# EAGLE schematic Ferdinand16 (EAGLE 7.5.0)
DESIGNER: Adam Green
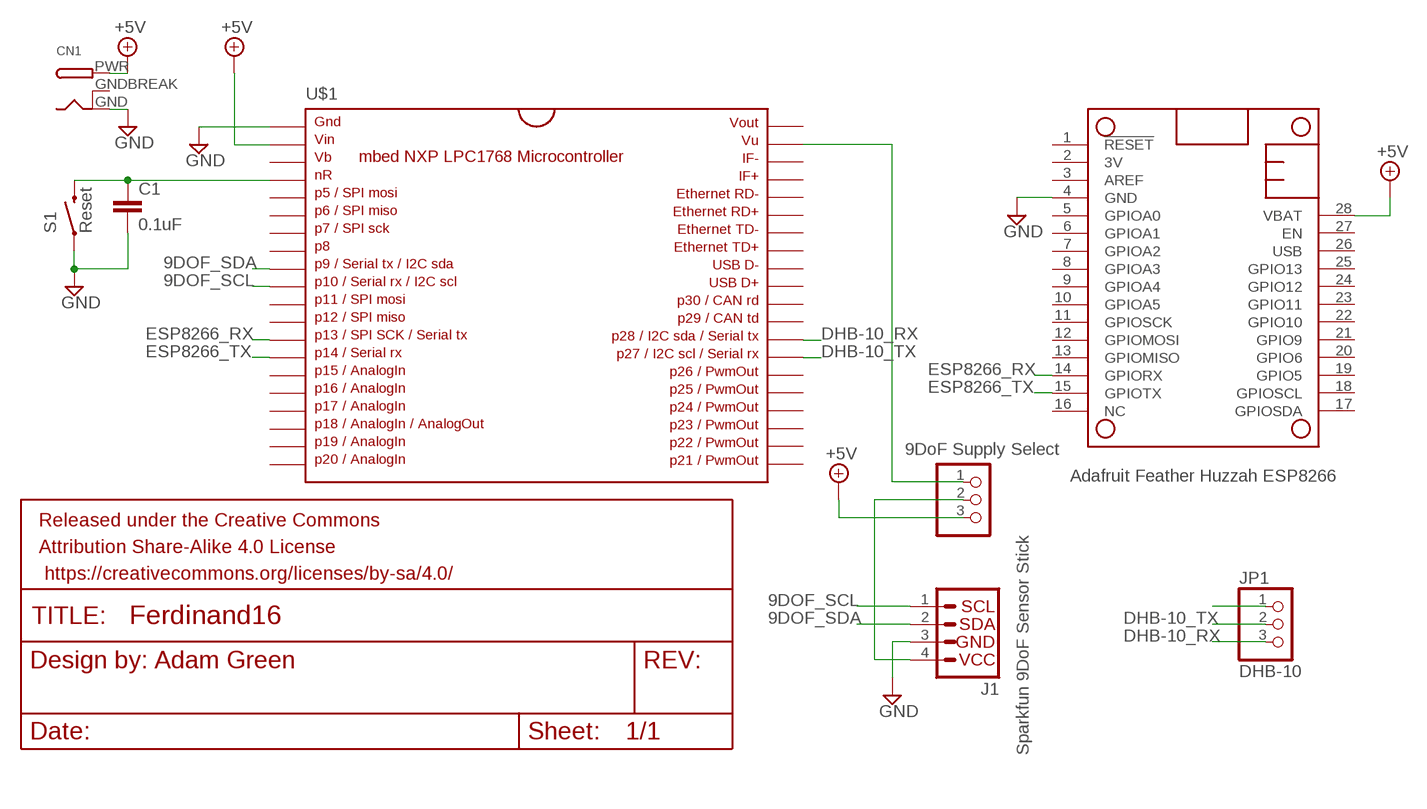
[diagram p0: schematic, sheet 1]

## Parts
C1  0.1uF  0.1UF-50V-20%(PTH)KIT-EZ  [CAP-PTH-SMALL-KIT]
CN1  DCBARRELPTH  [DCJACK_2MM_PTH]
J1  Sparkfun 9DoF Sensor Stick  9DOF_SENSOR_STICK  [1X04]
JP1  DHB-10  PINHD-1X3/90  [1X03/90]
JP2  9DoF Supply Select  PINHD-1X3/90  [1X03/90]
MS1  FEATHERWING  [FEATHERWING]
S1  Reset  SWITCH-MOMENTARY-2PTH  [TACTILE-PTH]
U$1  MBED_NXP_LPC1768  [DIL40_0.9]

## Nets
9DOF_SCL: J1.1 U$1.10
9DOF_SDA: J1.2 U$1.9
+5V: CN1.PWR JP2.3 MS1.28(VBAT) U$1.2
DHB-10_RX: JP1.3 U$1.28
DHB-10_TX: JP1.2 U$1.27
ESP8266_RX: MS1.14(GPIORX) U$1.13
ESP8266_TX: MS1.15(GPIOTX) U$1.14
GND: C1.2 CN1.GND J1.3 MS1.4(GND) S1.1 U$1.1
N$1: C1.1 S1.3 U$1.4
N$2: J1.4 JP2.2
N$3: JP2.1 U$1.39
N$20: JP1.1
Unconnected: MS1.1(!RESET) MS1.2(3V) MS1.3(AREF) MS1.5(GPIOA0) MS1.6(GPIOA1) MS1.7(GPIOA2) MS1.8(GPIOA3) MS1.9(GPIOA4) MS1.10(GPIOA5) MS1.11(GPIOSCK) MS1.12(GPIOMOSI) MS1.13(GPIOMISO) MS1.16(NC) MS1.17(GPIOSDA) MS1.18(GPIOSCL) MS1.19(GPIO5) MS1.20(GPIO6) MS1.21(GPIO9) MS1.22(GPIO10) MS1.23(GPIO11) MS1.24(GPIO12) MS1.25(GPIO13) MS1.26(USB) MS1.27(EN) U$1.3 U$1.5 U$1.6 U$1.7 U$1.8 U$1.11 U$1.12 U$1.15 U$1.16 U$1.17 U$1.18 U$1.19 U$1.20 U$1.21 U$1.22 U$1.23 U$1.24 U$1.25 U$1.26 U$1.29 U$1.30 U$1.31 U$1.32 U$1.33 U$1.34 U$1.35 U$1.36 U$1.37 U$1.38 U$1.40

## Notes on the sheet
- Adafruit Feather Huzzah ESP8266

## Power pins joined to a net without a drawn wire
GNDBREAK: CN1.GNDBREAK

## Library data of the parts
C1 = SparkFun-Capacitors:0.1UF-50V-20%(PTH): CAP-08370; PROD_ID: CAP-08370
CN1 = adafruit:DCBARREL: 2.0mm DC Barrel Jack DCJACK_2MM_PTH - Through Hole Jack (4UConnector: 05537)
J1 = adam_custom:9DOF_SENSOR_STICK: Sparkfun 9DoF Sensor Stick.
JP1 JP2 = pinhead:PINHD-1X3: PIN HEADER
MS1 = adafruit:FEATHERWING
S1 = SparkFun-Electromechanical:SWITCH-MOMENTARY-2: Various NO switches- pushbuttons, reed, etc; PROD_ID: SWCH-08441
U$1 = SparkFun-DigitalIC:MBED_NXP_LPC1768